# Altium schematic sheet rs485.SchDoc
size A4; SheetNumber: 4; SheetTotal: 4
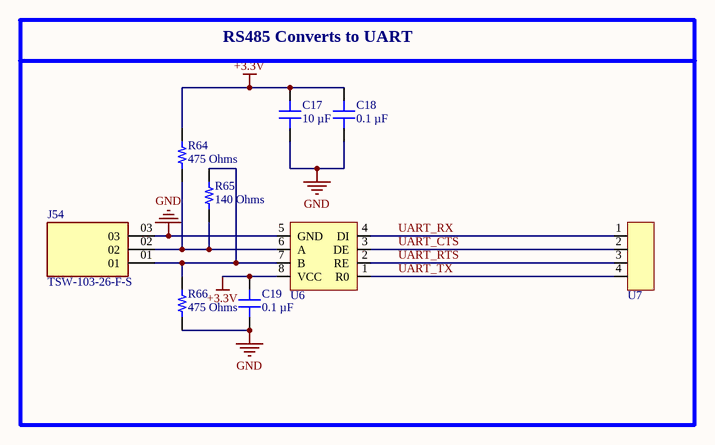
[diagram p0: rs485.SchDoc]

## Parts
C17  10 µF  [CAP 0603_1608]
C18  0.1 µF  [CAP 0603_1608]
C19  0.1 µF  [CAP 0603_1608]
J54  TSW-103-26-F-S  [SAMTEC_TSW-103-26-F-S]
R64  475 Ohms  [RES 0603_1608]
R65  140 Ohms  [RES 0603_1608]
R66  475 Ohms  [RES 0603_1608]
U6  SP3485  [SP3485]  (value not drawn)
U7  Con1x4_WireToWire  [Con1x4_WireToWire]  (value not drawn)

## Blocks framed on the sheet
RS485 Converts to UART: C17-C19 J54 R64-R66 U6 U7

## Nets
+3.3V: C17.2 C18.2 C19.2 R64.2 U6.8(VCC)
GND: C17.1 C18.1 C19.1 J54.03 R66.1 U6.5(GND)
UART_CTS: U6.3(DE) U7.2
UART_RTS: U6.2(RE) U7.3
UART_RX: U6.4(DI) U7.1
UART_TX: U6.1(R0) U7.4
NetJ54_01: J54.01 R65.2 R66.2 U6.7(B)
NetJ54_02: J54.02 R64.1 R65.1 U6.6(A)

## Library data of the parts
C17 = GRM188R60J106ME47D: CAP CER 10UF 6.3V X5R 0603; manufacturer: Murata Electronics; Tolerance: ±20%; Part Number: GRM188R60J106ME47D; Value: 10 µF; Applications: General Purpose; Capacitance: 10 µF; componentlink1description: Datasheet; componentlink1url: https://www.murata.com/~/media/webrenewal/support/library/catalog/products/capacitor/mlcc/c02e.ashx?la=en-us; componentlink2description: DigiKey Link; componentlink2url: https://www.digikey.com/en/products/detail/murata-electronics/GRM188R60J106ME47D/965910; Device Package: 0603 (1608 Metric); lastupdated: 08/03/2023 8:08:59 pm; Lifecycle Status: Active; Minimum Order: 1; Mounting Type: Surface Mount, MLCC; Operating Temperature: -55°C ~ 85°C; Package / Case: 0603 (1608 Metric); packaging: TapeAndReel; partid: 2351; Part Status: Active; price: 0.02; series: GRM; Size / Dimension: 0.063" L x 0.031" W (1.60mm x 0.80mm); Supplier 1: DigiKey; Supplier Part Number 1: 490-3896-1-ND; Temperature Coefficient: X5R; Thickness (Max): 0.035" (0.90mm); Voltage - Rated: 6.3V
C18 C19 = 6R3X14W104MV4T: CAP CER 0.1UF 6.3V X7R 0603; manufacturer: Johanson Dielectrics Inc.; Tolerance: ±20%; Part Number: 6R3X14W104MV4T; Value: 0.1 µF; Applications: Bypass, Decoupling; Capacitance: 0.1 µF; componentlink1description: Datasheet; componentlink1url: https://www.johansondielectrics.com/downloads/x2y-filter-and-decoupling-capacitors.pdf; componentlink2description: DigiKey Link; componentlink2url: https://www.digikey.com/en/products/detail/johanson-dielectrics-inc/6R3X14W104MV4T/1556331; Device Package: 0603 (1608 Metric); Features: Low ESL (X2Y); lastupdated: 08/03/2023 8:08:58 pm; Lifecycle Status: Active; Minimum Order: 1; Mounting Type: Surface Mount, MLCC; Operating Temperature: -55°C ~ 125°C; Package / Case: 0603 (1608 Metric); packaging: TapeAndReel; partid: 2650; Part Status: Active; price: 0.08; series: X2Y®; Size / Dimension: 0.064" L x 0.035" W (1.63mm x 0.89mm); Supplier 1: DigiKey; Supplier Part Number 1: 709-1009-1-ND; Temperature Coefficient: X7R; Thickness (Max): 0.026" (0.66mm); Voltage - Rated: 6.3V
R64 R66 = ERJ-PB3D4750V: RES SMD 475 OHM 0.5% 1/5W 0603; Manufacturer: Panasonic Electronic Components; Power (Watts): 0.2W, 1/5W; Temperature Coefficient: ±50ppm/°C; Part Number: ERJ-PB3D4750V; Value: 475 Ohms; ComponentLink1Description: Datasheet; ComponentLink1URL: https://industrial.panasonic.com/cdbs/www-data/pdf/RDM0000/AOA0000C328.pdf; ComponentLink2Description: DigiKey Link; ComponentLink2URL: http://digikey.com/product-detail/en/panasonic-electronic-components/ERJ-PB3D4750V/P20246CT-ND/6214501; Composition: Thick Film; Device Package: 0603 (1608 Metric); Features: Automotive AEC-Q200, Pulse Withstanding; Height - Seated (Max): 0.022" (0.55mm); LastUpdated: 08/03/2023 8:30:10 pm; Lifecycle Status: Active; Minimum Order: 1; Number of Terminations: 2; Operating Temperature: -55°C ~ 155°C; Package / Case: 0603 (1608 Metric); Packaging: TapeAndReel; PartId: 7092; Part Status: Active; Price: 0.02; Ratings: AEC-Q200; Resistance: 475 Ohms; Series: ERJ; Size / Dimension: 0.063" L x 0.031" W (1.60mm x 0.80mm); Supplier 1: DigiKey; Supplier Part Number 1: P20246CT-ND; Supplier Device Package: 0603; Tolerance: ±0.5%
R65 = RK73H1JTTD1400F: RES 140 OHM 1% 1/8W 0603; Manufacturer: KOA Speer Electronics, Inc.; Power (Watts): 0.125W, 1/8W; Temperature Coefficient: ±100ppm/°C; Part Number: RK73H1JTTD1400F; Value: 140 Ohms; ComponentLink1Description: Datasheet; ComponentLink1URL: http://www.koaspeer.com/catimages/Products/RK73H/RK73H.pdf; ComponentLink2Description: DigiKey Link; ComponentLink2URL: https://www.digikey.com/en/products/detail/koa-speer-electronics-inc/RK73H1JTTD1400F/9845188; Composition: Thick Film; Device Package: 0603 (1608 Metric); Features: Automotive AEC-Q200, Moisture Resistant; Height - Seated (Max): 0.022" (0.55mm); LastUpdated: 08/03/2023 8:30:04 pm; Lifecycle Status: Active; Minimum Order: 1; Number of Terminations: 2; Operating Temperature: -55°C ~ 155°C; Package / Case: 0603 (1608 Metric); Packaging: CutTape; PartId: 8740; Part Status: Active; Price: 0.01; Ratings: AEC-Q200; Resistance: 140 Ohms; Series: RK73H; Size / Dimension: 0.063" L x 0.031" W (1.60mm x 0.80mm); Supplier 1: DigiKey; Supplier Part Number 1: 2019-RK73H1JTTD1400FCT-ND; Supplier Device Package: 0603; Tolerance: ±1%
U7 = Con1x4_WireToWire: 1x4P XA 1 2.5mm 4 Copper Alloy Plugin,P=2.5mm Wire To Board / Wire To Wire Connector ROHS
J54 = TSW-103-26-F-S: Package: None; Price: None; Value: *; MP: TSW-103-26-F-S; Availability: Unavailable